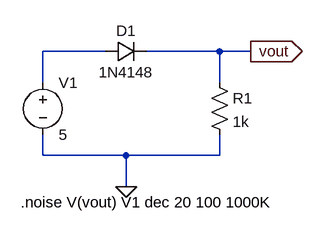
[diagram p0: schematic DiodeRRT.asc]
DiodeRRT.asc, the LTspice schematic file:
Version 4
SHEET 1 880 680
WIRE 192 112 96 112
WIRE 368 112 256 112
WIRE 416 112 368 112
WIRE 96 160 96 112
WIRE 368 160 368 112
WIRE 96 272 96 240
WIRE 224 272 96 272
WIRE 368 272 368 240
WIRE 368 272 224 272
WIRE 224 320 224 272
FLAG 224 320 0
FLAG 416 112 vout
IOPIN 416 112 Out
SYMBOL diode 192 128 R270
WINDOW 0 32 32 VTop 2
WINDOW 3 0 32 VBottom 2
SYMATTR InstName D1
SYMATTR Value 1N4148
SYMBOL res 352 144 R0
SYMATTR InstName R1
SYMATTR Value 1k
SYMBOL voltage 96 144 R0
WINDOW 123 0 0 Left 0
WINDOW 39 0 0 Left 0
SYMATTR InstName V1
SYMATTR Value 5
TEXT 62 344 Left 2 !.noise V(vout) V1 dec 20 100 1000K

The netlist it stands for:
* DiodeRRT.asc
D1 N001 vout 1N4148
R1 vout 0 1k
V1 N001 0 5
.model D D
.lib standard.dio
.noise V(vout) V1 dec 20 100 1000K
.backanno
.end